# EAGLE schematic Arduino HomeMonitorv1r4-current (EAGLE 6.6.0)
CNAME: Jeramy Brian; CREVISION: 4; DESIGNER: J.Brian
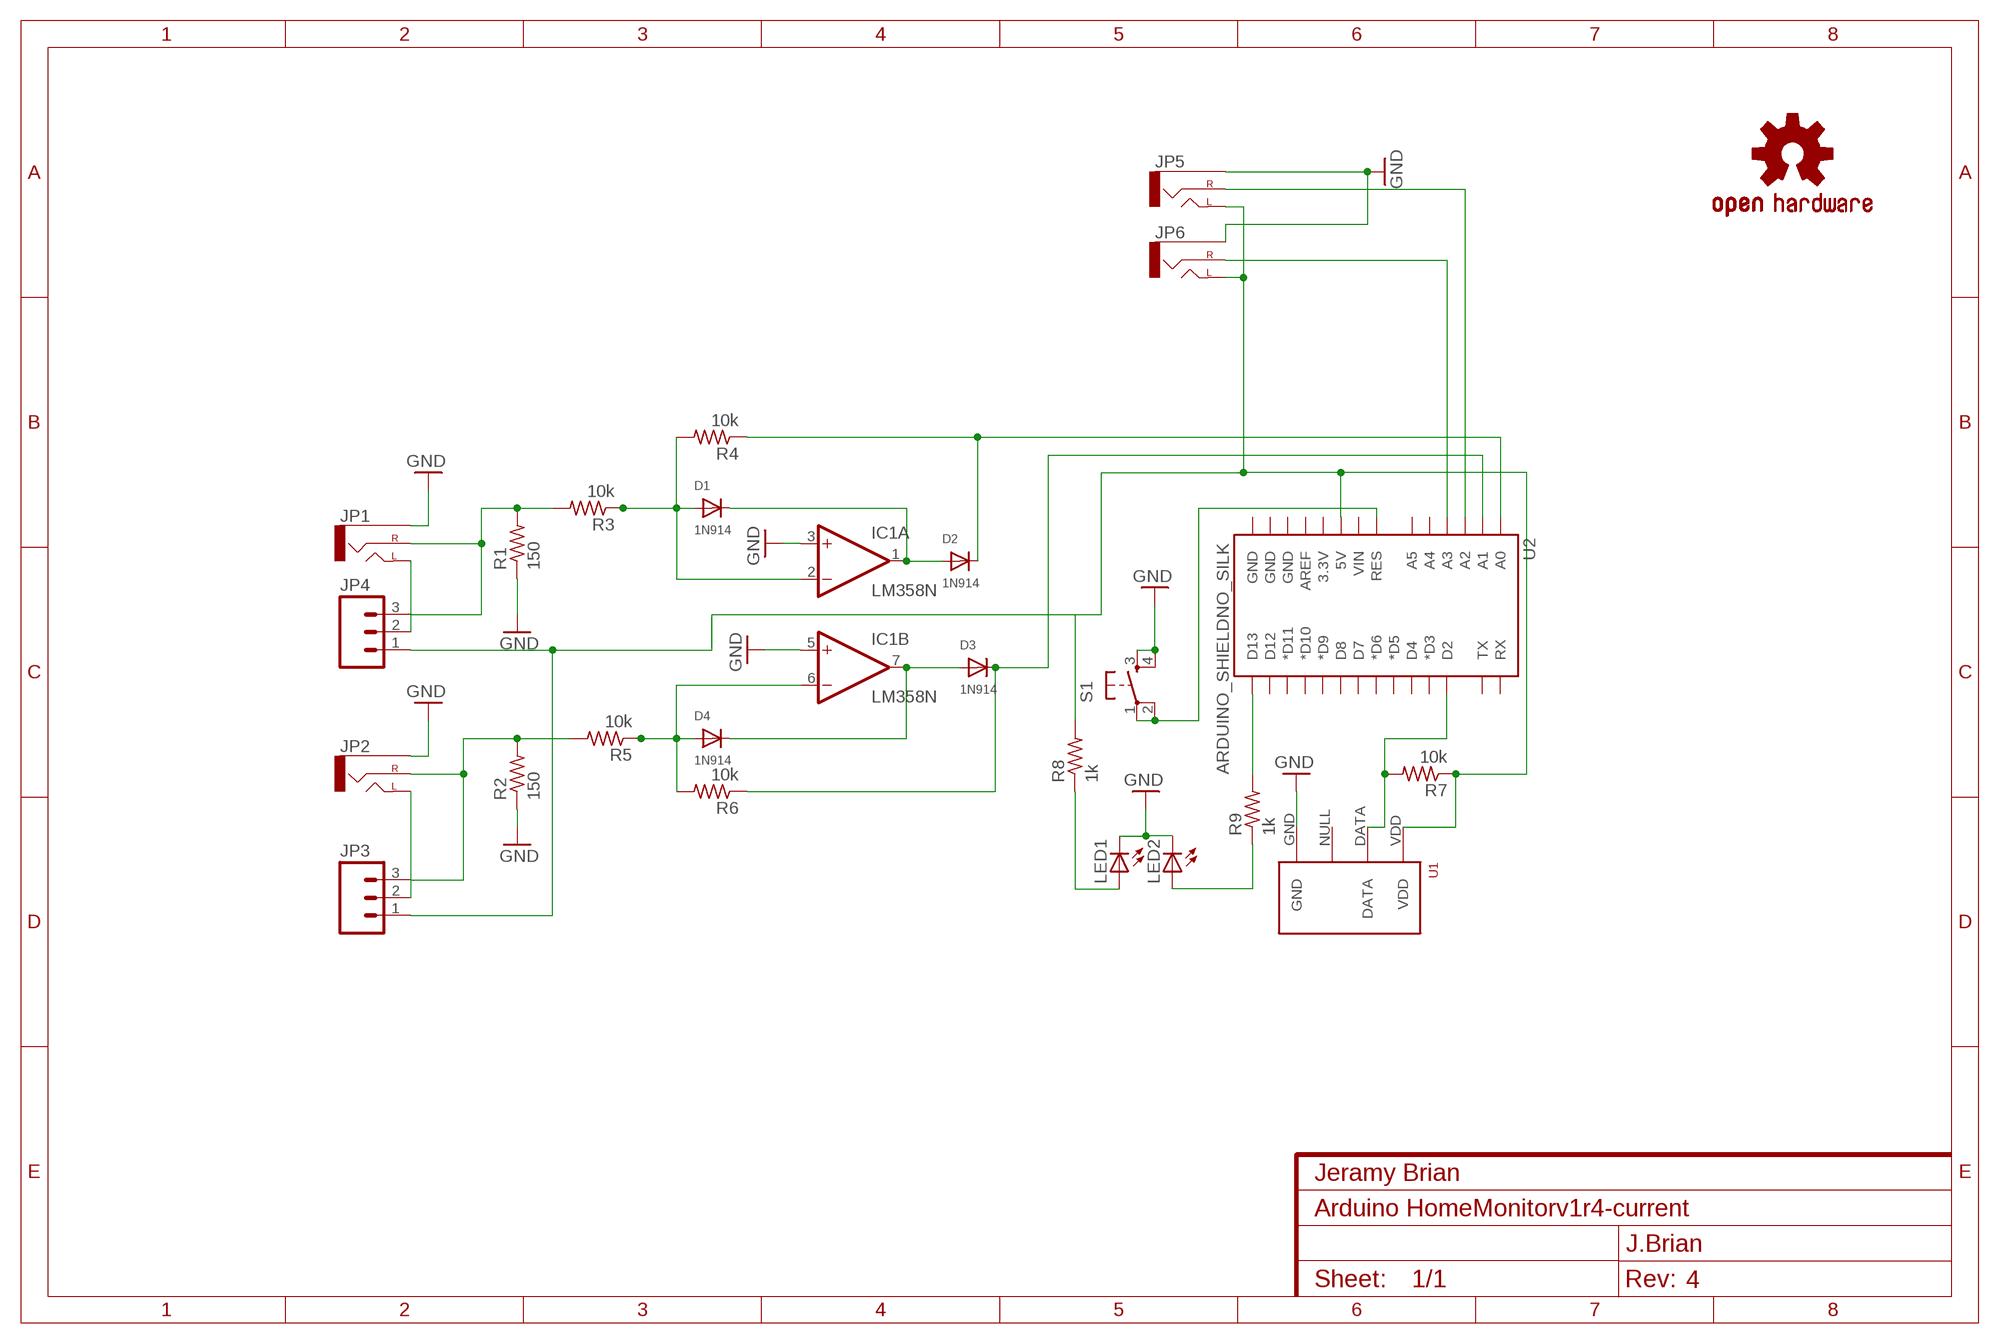
[diagram p0: schematic, sheet 1]

## Parts
D1  1N914  DIODEDO-1N4148  [DO-1N4148]
D2  1N914  DIODEDO-1N4148  [DO-1N4148]
D3  1N914  DIODEDO-1N4148  [DO-1N4148]
D4  1N914  DIODEDO-1N4148  [DO-1N4148]
IC1  LM358N  [DIL08]
JP1  AUDIO-JACKPTH  [AUDIO-JACK]
JP2  AUDIO-JACKPTH  [AUDIO-JACK]
JP3  M03PTH  [1X03]
JP4  M03PTH  [1X03]
JP5  AUDIO-JACKPTH  [AUDIO-JACK]
JP6  AUDIO-JACKPTH  [AUDIO-JACK]
LED1  LED3MM  [LED3MM]
LED2  LED3MM  [LED3MM]
LOGO1  OSHW-LOGOL  [OSHW-LOGO-L]
R1  150  R-US_R0805  [R0805]
R2  150  R-US_R0805  [R0805]
R3  10k  R-US_R0805  [R0805]
R4  10k  R-US_R0805  [R0805]
R5  10k  R-US_R0805  [R0805]
R6  10k  R-US_R0805  [R0805]
R7  10k  R-US_R0805  [R0805]
R8  1k  R-US_R0805  [R0805]
R9  1k  R-US_R0805  [R0805]
S1  TAC_SWITCHPTH  [TACTILE-PTH]
U1  RHT03_DHT-22_AM2302  [RHT03_DHT-22]
U2  ARDUINO_SHIELDNO_SILK  [DUEMILANOVE_VIAS]

## Nets
GND: IC1.3(A:+IN) IC1.5(B:+IN) JP1.SLEEVE JP2.SLEEVE JP5.SLEEVE JP6.SLEEVE LED1.K(C) LED2.K(C) R1.1 R2.1 S1.3 S1.4 U1.GND
N$1: JP1.RING(RIGHT) JP4.3 R1.2 R3.2
N$2: JP2.RING(RIGHT) JP3.3 R2.2 R5.2
N$3: D1.A IC1.2(A:-IN) R3.1 R4.2
N$4: D4.A IC1.6(B:-IN) R5.1 R6.2
N$5: D3.A D4.C IC1.7(B:OUT)
N$6: D1.C D2.A IC1.1(A:OUT)
N$7: JP6.RING(RIGHT) U2.A3
N$8: JP5.RING(RIGHT) U2.A2
N$9: JP2.TIP(LEFT) JP3.2
N$10: JP1.TIP(LEFT) JP4.2
N$11: D3.C R6.1 U2.A1
N$12: D2.C R4.1 U2.A0
N$13: R7.2 U1.DATA U2.D2
N$14: JP3.1 JP4.1 JP5.TIP(LEFT) JP6.TIP(LEFT) R7.1 R8.2 U1.VDD U2.5V
N$15: R9.2 U2.D13
N$16: S1.1 S1.2 U2.RES
N$17: LED2.A R9.1
N$18: LED1.A R8.1
Unconnected: U1.NULL U2.3.3V U2.A4 U2.A5 U2.AREF U2.D3(*D3) U2.D4 U2.D5(*D5) U2.D6(*D6) U2.D7 U2.D8 U2.D9(*D9) U2.D10(*D10) U2.D11(*D11) U2.D12 U2.GND@0(GND) U2.GND@1(GND) U2.GND@2(GND) U2.RX U2.TX U2.VIN

## Power pins joined to a net without a drawn wire
V+: IC1.8(P:V+)
V-: IC1.4(P:V-)

## Library data of the parts
D1-D4 = adafruit:DIODE: Diode SMADIODE - SMA Surface Mount Package 20V 1A Schottky Diode Digikey: 641-1014-6-ND DO-1N4148 - Through Hole Small Current Diode SOD-123 20V 1 A (.5mV Vf) Schottky Diode - Digikey: MBRX120TPMSCT-ND SOD-323 10V 570mA (.38mV Vf, 3ns) Schottky Diode - Digikey: ZLLS410CT-ND SOD-523 30V 30mA Schottky Diode (RB751S-40TE61) - Digikey: RB751S-40TE61CT-ND SOT23-R/W - SOT23 Package (R = Solder Paste/Reflow Ovens, W = Hand-Soldering) BAT54Film 40V 300mA - Digikey: 497-7162-1-ND
IC1 = gm-ics:LM358: OP AMP
JP1 JP2 JP5 JP6 = SparkFun-Connectors:AUDIO-JACK: 3.5mm Audio Jack Simple 3.5mm common PCB mount audio jack. SKU: PRT-08032
JP3 JP4 = SparkFun-Connectors:M03: Header 3 Standard 3-pin 0.1" header. Use with straight break away headers (SKU : PRT-00116), right angle break away headers (PRT-00553), swiss pins (PRT-00743), machine pins (PRT-00117), and female headers (PRT-00115). Molex polarized connector foot print use with SKU : PRT-08232 with associated crimp pins and housings.
LED1 LED2 = adafruit:LED: LED OSRAM: - CHIPLED LG R971, LG N971, LY N971, LG Q971, LY Q971, LO R971, LY R971 LH N974, LH R974 LS Q976, LO Q976, LY Q976 LO Q996 - Hyper CHIPLED LW Q18S LB Q993, LB Q99A, LB R99A - SideLED LS A670, LO A670, LY A670, LG A670, LP A670 LB A673, LV A673, LT A673, LW A673 LH A674 LY A675 LS A676, LA A676, LO A676, LY A676, LW A676 LS A679, LY A679, LG A679 - Hyper Micro SIDELED® LS Y876, LA Y876, LO Y876, LY Y876 LT Y87S - SmartLED LW L88C, LW L88S LB L89C, LB L89S, LG L890 LS L89K, LO L89K, LY L89K LS L896, LA L896, LO L896, LY L896 - TOPLED LS T670, LO T670, LY T670, LG T670, LP T670 LSG T670, LSP T670, LSY T670, LOP T670, LYG T670 LG T671, LOG T671, LSG T671 LB T673, LV T673, LT T673, LW T673 LH T674 LS T676, LA T676, LO T676, LY T676, LB T676, LH T676, LSB T676, LW T676 LB T67C, LV T67C, LT T67C, LS T67K, LO T67K, LY T67K, LW E67C LS E67B, LA E67B, LO E67B, LY E67B, LB E67C, LV E67C, LT E67C LW T67C LS T679, LY T679, LG T679 LS T770, LO T770, LY T770, LG T770, LP T770 LB T773, LV T773, LT T773, LW T773 LH T774 LS E675, LA E675, LY E675, LS T675 LS T776, LA T776, LO T776, LY T776, LB T776 LHGB T686 LT T68C, LB T68C - Hyper Mini TOPLED® LB M676 - Mini TOPLED Santana® LG M470 LS M47K, LO M47K, LY M47K Source: http://www.osram.convergy.de/
LOGO1 = SparkFun-Aesthetics:OSHW-LOGO: Open Source Hardware Logo This logo indicates the piece of hardware it is found on incorporates a OSHW license and/or adheres to the definition of open source hardware found here: http://freedomdefined.org/OSHW
R1-R9 = adafruit:R-US_: RESISTOR, American symbol
S1 = SparkFun-Electromechanical:TAC_SWITCH: Momentary Switch Button commonly used for reset or general input. Spark Fun Electronics SKU : COM-00097 SMT- SWCH-08247
U1 = RHT03_DHT-22_AM2302:RHT03_DHT-22_AM2302: RHT03 / DHT-22 / AM2302 Packages and symbol for the RHT03 / DHT-22 relative humidity and temperature sensor. Note: The AM2302 is a wired version of the DHT-22 which typically requires less clearance and is thus provided as a separate package.; PROD_ID: SEN-10167
U2 = SparkFun-Boards:ARDUINO_SHIELD: Arduino shield footprint